# Altium project MAX14871_DC_Motor_Driver.PrjPcb (part 3 of 3)
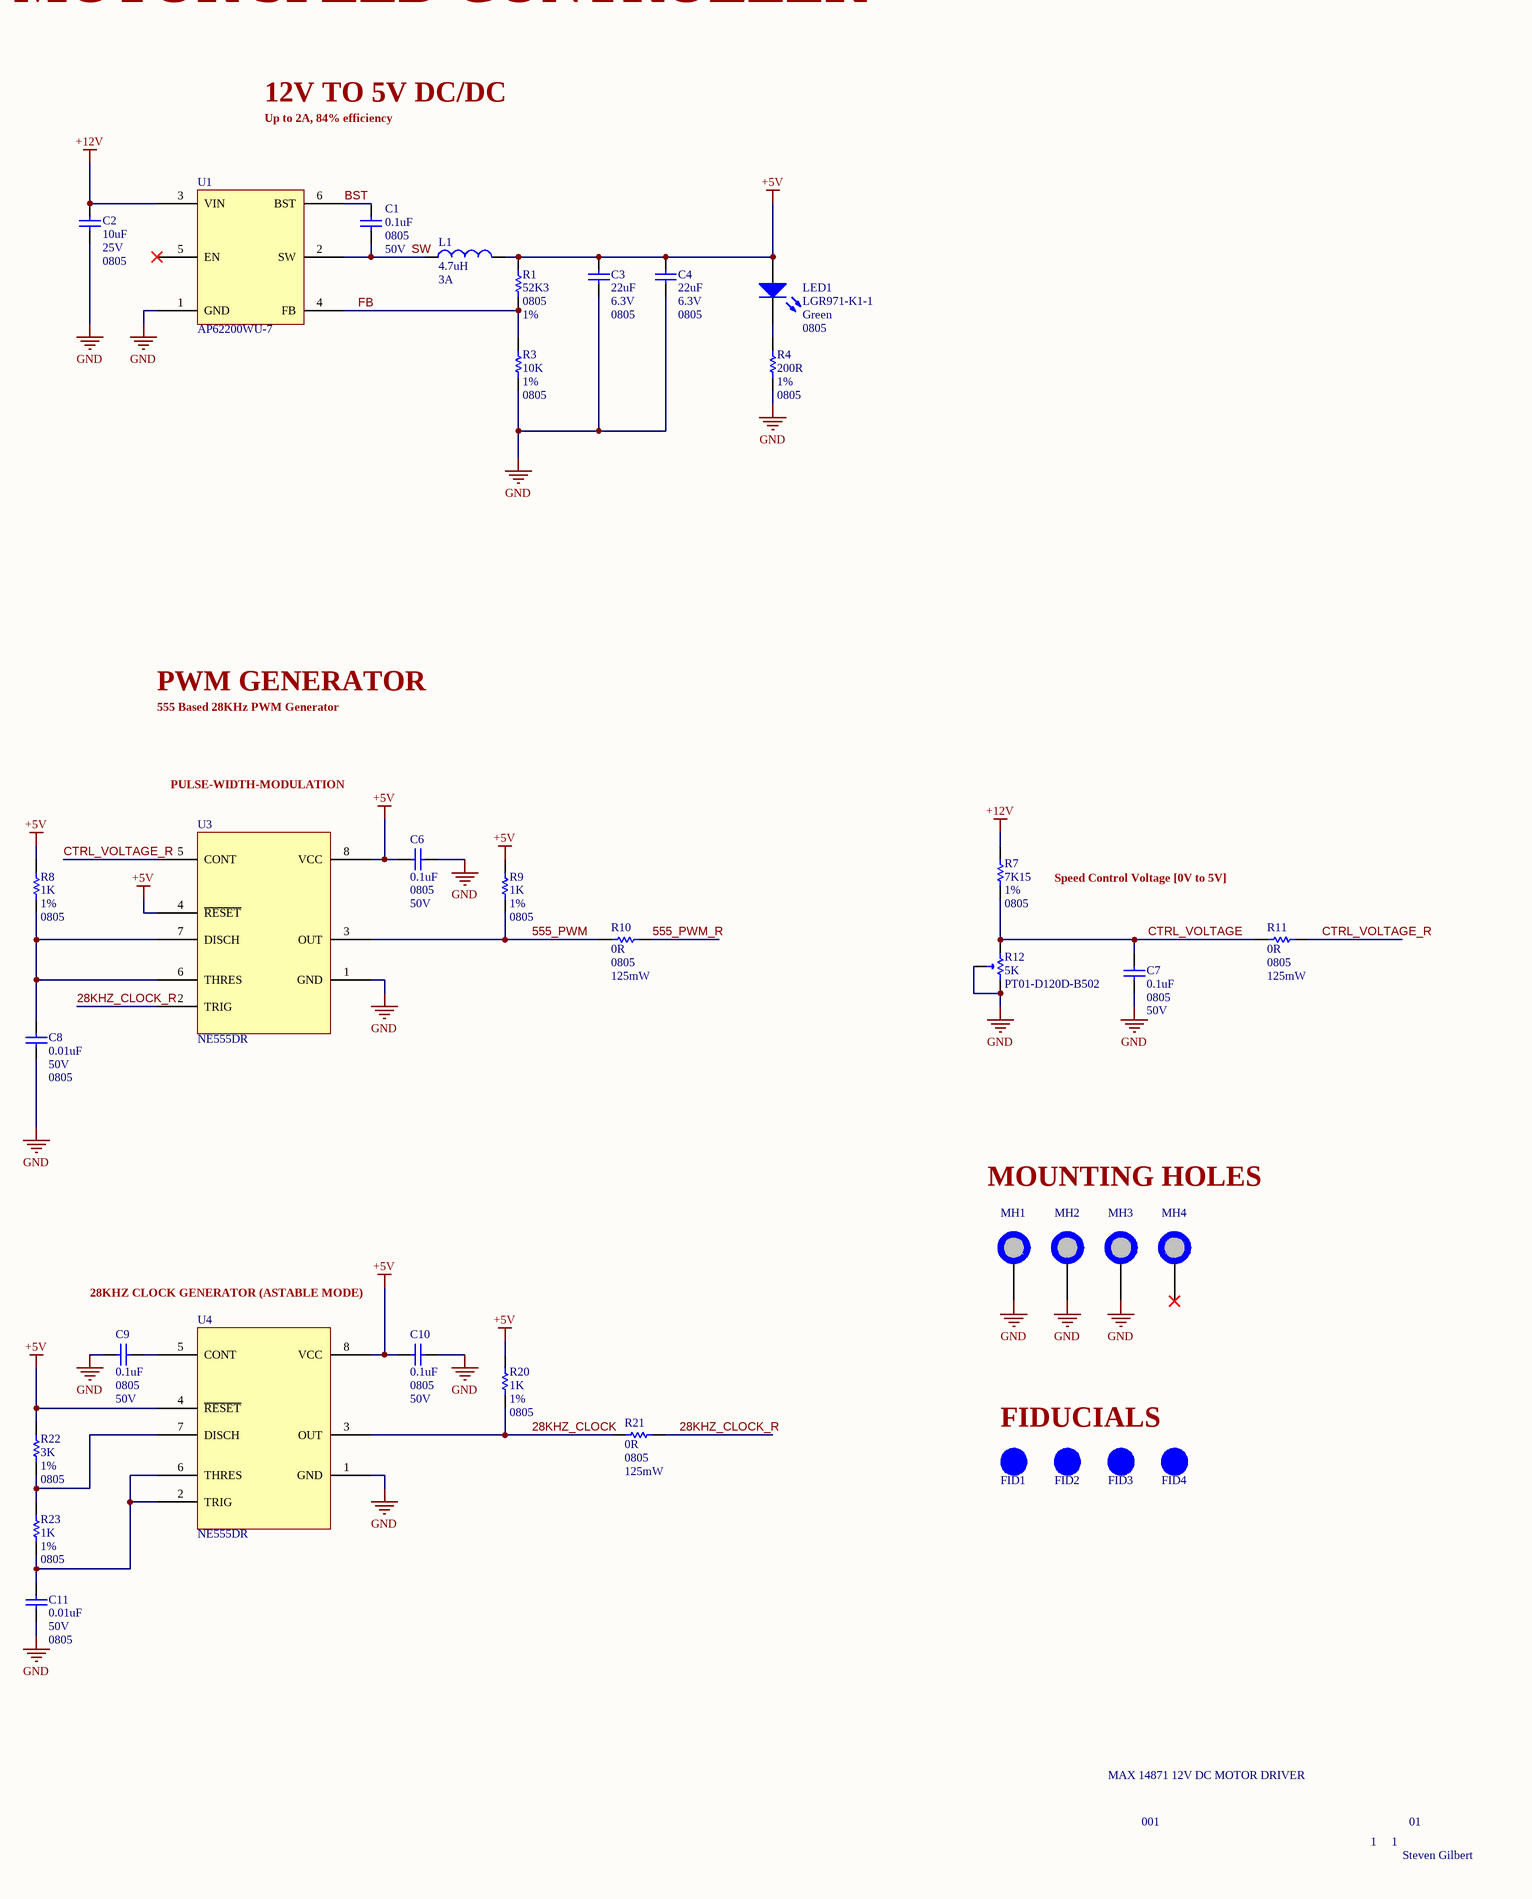
[diagram p3: 14871_Schematic.SchDoc, right]

## Sheet 14871_Schematic.SchDoc (continued)

### Library data of the parts (continued)
U3 U4 = NE555DR: IC OSC SGL TIMER 100KHZ 8-SOIC; Manufacturer: Texas Instruments; Quiescent Current: 15mA; Number of Timers/Counters: 1; High Level Output Current: -200mA; Low Level Output Current: 200mA; Max Supply Voltage: 16V; Min Supply Voltage: 4.5V; Operating Supply Current: 10mA; Supplier 1: Digi-Key; Manufacturer Part Number: NE555DR; RoHS: Yes; Category: Timers and Oscillators; Stock 1: 369283; Pricing 1: 1=0.46000, 10=0.34300, 25=0.30880, 100=0.21350, 250=0.17976, 500=0.14606, 1000=0.11236 (USD); Mount: Surface Mount; Case/Package: SOIC; Number of Pins: 8; Weight: 0.002561oz; Contact Plating: Gold; Min Operating Temperature: 0°C; Max Operating Temperature: 70°C; Packaging: Tape and Reel; Frequency: 100kHz; Package Quantity: 1; Series: -; Length: 4.9mm; Width: 3.91mm; Height: 1.58mm; Radiation Hardening: No; Lead Free: Lead Free; Reach SVHC Compliant: Yes; RoHS Compliant: Yes; ComponentLink1URL: https://datasheet.ciiva.com/46395/1874740-46395978.pdf?src-supplier=Element14; ComponentLink1Description: https://datasheet.ciiva.com/46395/1874740-46395978.pdf?src-supplier=Element14; ComponentLink2URL: https://datasheet.ciiva.com/1233/ne555-1233132.pdf?src-supplier=Digi-Key; ComponentLink2Description: https://datasheet.ciiva.com/1233/ne555-1233132.pdf?src-supplier=Digi-Key; ComponentLink3URL: https://datasheet.ciiva.com/1233/ne555-1233131.pdf?src-supplier=Digi-Key; ComponentLink3Description: https://datasheet.ciiva.com/1233/ne555-1233131.pdf?src-supplier=Digi-Key; ComponentLink4URL: https://datasheet.ciiva.com/1233/ne555-1233133.pdf?src-supplier=Digi-Key; ComponentLink4Description: https://datasheet.ciiva.com/1233/ne555-1233133.pdf?src-supplier=Digi-Key; ComponentLink5URL: https://datasheet.ciiva.com/1139/1874740-1139901.pdf?src-supplier=Element14; ComponentLink5Description: https://datasheet.ciiva.com/1139/1874740-1139901.pdf?src-supplier=Element14; Supplier Part Number 1: 296-6501-1-ND

## Assembly variants
001: not fitted C6 C9